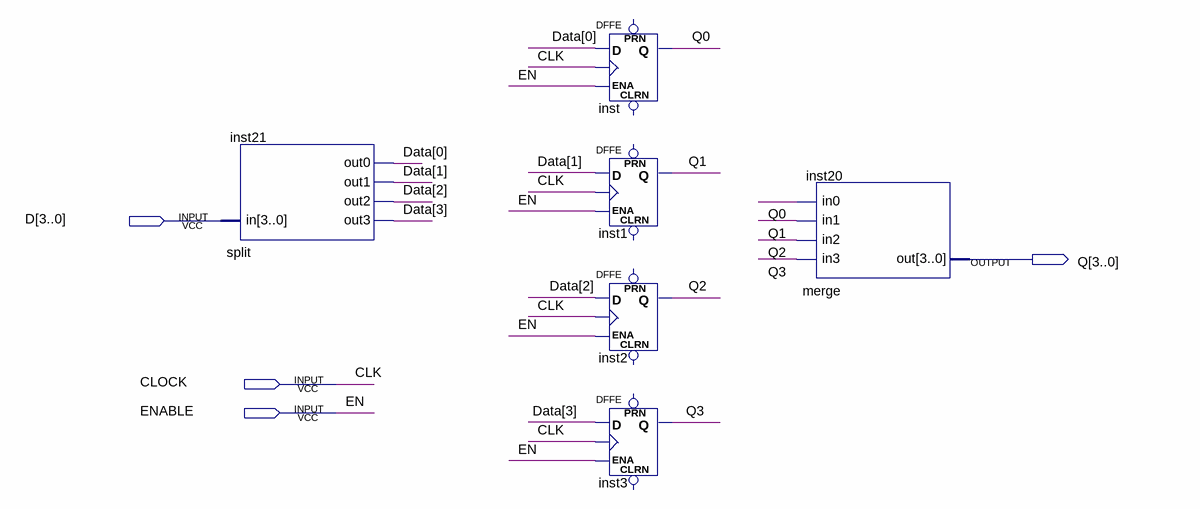
[diagram p0: schematic sheet]
// Quartus schematic Register.bdf as structural Verilog: 6 symbols, 4 pins
module Register (
  input  [3:0] D,
  input  CLOCK,
  input  ENABLE,
  output [3:0] Q
);

  wire [3:0] Data;

  split inst21 (.in(D), .out3(Data[3]), .out2(Data[2]), .out1(Data[1]), .out0(Data[0]));
  DFFE inst (.D(Data[0]), .CLK(CLOCK), .ENA(ENABLE), .Q(Q[0]));  // open: PRN, CLRN
  DFFE inst1 (.D(Data[1]), .CLK(CLOCK), .ENA(ENABLE), .Q(Q[1]));  // open: PRN, CLRN
  DFFE inst2 (.D(Data[2]), .CLK(CLOCK), .ENA(ENABLE), .Q(Q[2]));  // open: PRN, CLRN
  DFFE inst3 (.D(Data[3]), .CLK(CLOCK), .ENA(ENABLE), .Q(Q[3]));  // open: PRN, CLRN
  merge inst20 (.in3(Q[3]), .in2(Q[2]), .in1(Q[1]), .in0(Q[0]), .out(Q));

  // Other names for the same wires on the sheet: CLK = CLOCK; EN = ENABLE
endmodule
